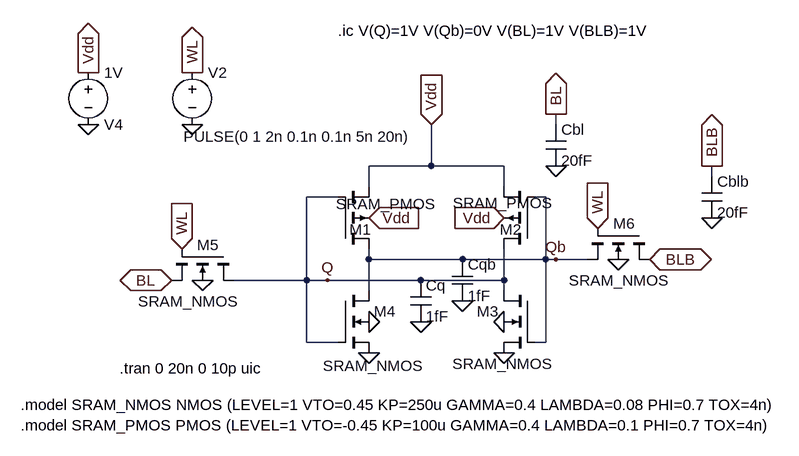
[diagram p0: schematic READ_sram_6t_healthy.asc]
READ_sram_6t_healthy.asc, the LTspice schematic file:
Version 4.1
SHEET 1 880 680
WIRE 400 -16 400 -32
WIRE 208 48 208 -16
WIRE 208 48 112 48
WIRE 320 48 208 48
WIRE 640 64 640 48
WIRE 112 80 112 48
WIRE 320 80 320 48
WIRE 64 96 16 96
WIRE 384 96 368 96
WIRE 112 192 112 176
WIRE 256 192 112 192
WIRE 384 192 384 96
WIRE 384 192 256 192
WIRE 400 192 384 192
WIRE 448 192 400 192
WIRE 16 224 16 96
WIRE 16 224 -96 224
WIRE 48 224 16 224
WIRE 192 224 48 224
WIRE 320 224 320 176
WIRE 320 224 192 224
WIRE 112 240 112 192
WIRE 320 240 320 224
WIRE 16 320 16 224
WIRE 64 320 16 320
WIRE 384 320 384 192
WIRE 384 320 368 320
FLAG 112 336 0
FLAG 320 336 0
FLAG 544 192 BLB
IOPIN 544 192 BiDir
FLAG -192 224 BL
IOPIN -192 224 BiDir
FLAG 464 144 WL
IOPIN 464 144 In
FLAG -176 176 WL
IOPIN -176 176 In
FLAG -160 -16 0
FLAG -160 -96 WL
IOPIN -160 -96 Out
FLAG 320 288 0
FLAG 112 288 0
FLAG -144 224 0
FLAG 496 192 0
FLAG 112 128 Vdd
IOPIN 112 128 In
FLAG 320 128 Vdd
IOPIN 320 128 In
FLAG -320 -16 0
FLAG -320 -96 Vdd
IOPIN -320 -96 Out
FLAG 208 -16 Vdd
IOPIN 208 -16 In
FLAG 48 224 Q
FLAG 400 192 Qb
FLAG 192 288 0
FLAG 256 256 0
FLAG 400 -32 BL
IOPIN 400 -32 Out
FLAG 640 48 BLB
IOPIN 640 48 Out
FLAG 400 48 0
FLAG 640 128 0
SYMBOL pmos4 64 176 M180
WINDOW 0 18 30 Left 2
WINDOW 3 -3 69 Left 2
SYMATTR InstName M1
SYMATTR Value SRAM_PMOS
SYMATTR Value2 l=180nm w=360nm
SYMBOL pmos4 368 176 R180
WINDOW 0 21 30 Left 2
WINDOW 3 -26 71 Left 2
SYMATTR InstName M2
SYMATTR Value SRAM_PMOS
SYMATTR Value2 l=180nm w=360nm
SYMBOL nmos4 368 240 M0
WINDOW 3 -27 113 Left 2
SYMATTR Value SRAM_NMOS
SYMATTR InstName M3
SYMATTR Value2 l=180nm w=720nm
SYMBOL nmos4 64 240 R0
WINDOW 3 -23 116 Left 2
SYMATTR Value SRAM_NMOS
SYMATTR InstName M4
SYMATTR Value2 l=180nm w=720nm
SYMBOL voltage -320 -112 R0
WINDOW 0 24 96 Left 2
WINDOW 3 24 16 Left 2
WINDOW 123 0 0 Left 0
WINDOW 39 0 0 Left 0
SYMATTR InstName V4
SYMATTR Value 1V
SYMBOL nmos4 -96 176 R90
WINDOW 0 -6 23 VRight 2
WINDOW 3 81 -7 VRight 2
SYMATTR InstName M5
SYMATTR Value SRAM_NMOS
SYMATTR Value2 l=180nm w=540nm
SYMBOL nmos4 544 144 R90
WINDOW 0 -7 22 VRight 2
WINDOW 3 80 -30 VRight 2
SYMATTR InstName M6
SYMATTR Value SRAM_NMOS
SYMATTR Value2 l=180nm w=540nm
SYMBOL voltage -160 -112 R0
WINDOW 123 0 0 Left 0
WINDOW 39 0 0 Left 0
WINDOW 3 -13 115 Left 2
SYMATTR Value PULSE(0 1 2n 0.1n 0.1n 5n 20n)
SYMATTR InstName V2
SYMBOL cap 384 -16 R0
SYMATTR InstName Cbl
SYMATTR Value 20fF
SYMATTR SpiceLine IC=1
SYMBOL cap 624 64 R0
SYMATTR InstName Cblb
SYMATTR Value 20fF
SYMATTR SpiceLine IC=1
SYMBOL cap 176 224 R0
SYMATTR InstName Cq
SYMATTR Value 1fF
SYMBOL cap 240 192 R0
SYMATTR InstName Cqb
SYMATTR Value 1fF
TEXT -272 360 Left 2 !.tran 0 20n 0 10p uic
TEXT -424 416 Left 2 !.model SRAM_NMOS NMOS (LEVEL=1 VTO=0.45 KP=250u GAMMA=0.4 LAMBDA=0.08 PHI=0.7 TOX=4n)\n.model SRAM_PMOS PMOS (LEVEL=1 VTO=-0.45 KP=100u GAMMA=0.4 LAMBDA=0.1 PHI=0.7 TOX=4n)
TEXT 64 -160 Left 2 !.ic V(Q)=1V V(Qb)=0V V(BL)=1V V(BLB)=1V

The netlist it stands for:
* READ_sram_6t_healthy.asc
M1 Qb Q Vdd Vdd SRAM_PMOS l=180nm w=360nm
M2 Q Qb Vdd Vdd SRAM_PMOS l=180nm w=360nm
M3 Q Qb 0 0 SRAM_NMOS l=180nm w=720nm
M4 Qb Q 0 0 SRAM_NMOS l=180nm w=720nm
V4 Vdd 0 1V
M5 Q WL BL 0 SRAM_NMOS l=180nm w=540nm
M6 BLB WL Qb 0 SRAM_NMOS l=180nm w=540nm
V2 WL 0 PULSE(0 1 2n 0.1n 0.1n 5n 20n)
Cbl BL 0 20fF IC=1
Cblb BLB 0 20fF IC=1
Cq Q 0 1fF
Cqb Qb 0 1fF
.model NMOS NMOS
.model PMOS PMOS
.lib standard.mos
.tran 0 20n 0 10p uic
.model SRAM_NMOS NMOS (LEVEL=1 VTO=0.45 KP=250u GAMMA=0.4 LAMBDA=0.08 PHI=0.7 TOX=4n)
.model SRAM_PMOS PMOS (LEVEL=1 VTO=-0.45 KP=100u GAMMA=0.4 LAMBDA=0.1 PHI=0.7 TOX=4n)
.ic V(Q)=1V V(Qb)=0V V(BL)=1V V(BLB)=1V
.backanno
.end